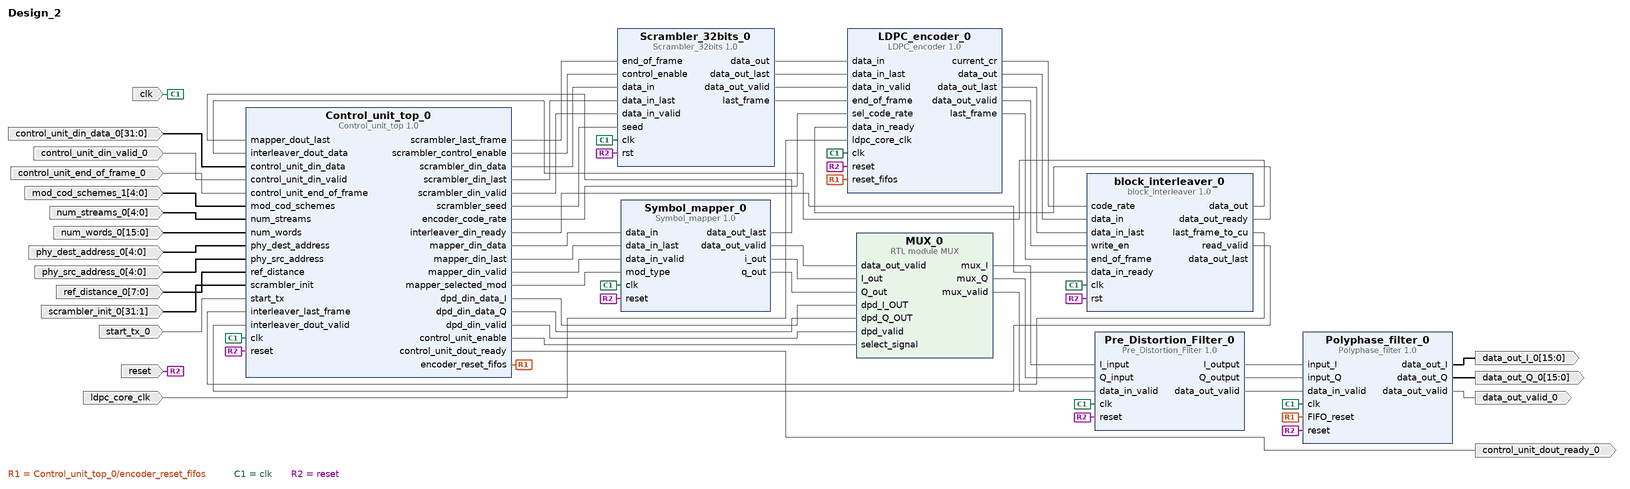
[diagram p0: block diagram of the top level]
# Vivado block design Design_2, xczu28dr-ffvg1517-2-e, Vivado 2021.2
create_bd_design Design_2

create_bd_port -dir I -type clk clk
set_property -dict {CONFIG.ASSOCIATED_RESET reset} [get_bd_ports clk]
create_bd_port -dir I -type clk ldpc_core_clk
create_bd_port -dir I -type rst reset
create_bd_port -dir O data_out_valid_0
create_bd_port -dir O -from 15 -to 0 data_out_I_0
create_bd_port -dir O -from 15 -to 0 data_out_Q_0
create_bd_port -dir O control_unit_dout_ready_0
create_bd_port -dir I -from 31 -to 0 control_unit_din_data_0
create_bd_port -dir I control_unit_din_valid_0
create_bd_port -dir I control_unit_end_of_frame_0
create_bd_port -dir I -from 31 -to 1 scrambler_init_0
create_bd_port -dir I -from 7 -to 0 ref_distance_0
create_bd_port -dir I -from 4 -to 0 num_streams_0
create_bd_port -dir I -from 15 -to 0 num_words_0
create_bd_port -dir I start_tx_0
create_bd_port -dir I -from 4 -to 0 phy_src_address_0
create_bd_port -dir I -from 4 -to 0 phy_dest_address_0
create_bd_port -dir I -from 4 -to 0 mod_cod_schemes_1

create_bd_cell -type ip -vlnv user.org:user:block_interleaver:1.0 block_interleaver_0
create_bd_cell -type ip -vlnv user.org:user:Scrambler_32bits:1.0 Scrambler_32bits_0
create_bd_cell -type ip -vlnv user.org:user:Pre_Distortion_Filter:1.0 Pre_Distortion_Filter_0
create_bd_cell -type module -reference MUX MUX_0
create_bd_cell -type ip -vlnv user.org:user:Symbol_mapper:1.0 Symbol_mapper_0
create_bd_cell -type ip -vlnv user.org:user:Control_unit_top:1.0 Control_unit_top_0
create_bd_cell -type ip -vlnv user.org:user:LDPC_encoder:1.0 LDPC_encoder_0
create_bd_cell -type ip -vlnv user.org:user:Polyphase_filter:1.0 Polyphase_filter_0

# ---- connections ----

connect_bd_net [get_bd_pins Control_unit_top_0/control_unit_dout_ready] [get_bd_ports control_unit_dout_ready_0]
connect_bd_net -net Control_unit_top_0_control_unit_last_frame [get_bd_pins Control_unit_top_0/scrambler_last_frame] \
  [get_bd_pins Scrambler_32bits_0/end_of_frame]
connect_bd_net [get_bd_pins Control_unit_top_0/dpd_din_data_I] [get_bd_pins MUX_0/dpd_I_OUT]
connect_bd_net [get_bd_pins Control_unit_top_0/dpd_din_data_Q] [get_bd_pins MUX_0/dpd_Q_OUT]
connect_bd_net [get_bd_pins Control_unit_top_0/dpd_din_valid] [get_bd_pins MUX_0/dpd_valid]
connect_bd_net [get_bd_pins Control_unit_top_0/encoder_code_rate] [get_bd_pins LDPC_encoder_0/sel_code_rate]
connect_bd_net [get_bd_pins Control_unit_top_0/encoder_reset_fifos] \
  [get_bd_pins LDPC_encoder_0/reset_fifos] [get_bd_pins Polyphase_filter_0/FIFO_reset]
connect_bd_net [get_bd_pins Control_unit_top_0/interleaver_din_ready] [get_bd_pins block_interleaver_0/data_in_ready]
connect_bd_net [get_bd_pins Control_unit_top_0/mapper_din_data] [get_bd_pins Symbol_mapper_0/data_in]
connect_bd_net [get_bd_pins Control_unit_top_0/mapper_din_last] [get_bd_pins Symbol_mapper_0/data_in_last]
connect_bd_net [get_bd_pins Control_unit_top_0/mapper_din_valid] [get_bd_pins Symbol_mapper_0/data_in_valid]
connect_bd_net -net Control_unit_top_0_mapper_pilot_insertion_en [get_bd_pins Control_unit_top_0/control_unit_enable] \
  [get_bd_pins MUX_0/select_signal]
connect_bd_net [get_bd_pins Control_unit_top_0/mapper_selected_mod] [get_bd_pins Symbol_mapper_0/mod_type]
connect_bd_net [get_bd_pins Control_unit_top_0/scrambler_control_enable] [get_bd_pins Scrambler_32bits_0/control_enable]
connect_bd_net [get_bd_pins Control_unit_top_0/scrambler_din_data] [get_bd_pins Scrambler_32bits_0/data_in]
connect_bd_net [get_bd_pins Control_unit_top_0/scrambler_din_last] [get_bd_pins Scrambler_32bits_0/data_in_last]
connect_bd_net [get_bd_pins Control_unit_top_0/scrambler_din_valid] [get_bd_pins Scrambler_32bits_0/data_in_valid]
connect_bd_net [get_bd_pins Control_unit_top_0/scrambler_seed] [get_bd_pins Scrambler_32bits_0/seed]
connect_bd_net [get_bd_pins LDPC_encoder_0/current_cr] [get_bd_pins block_interleaver_0/code_rate]
connect_bd_net -net LDPC_encoder_0_data_out_1_2 [get_bd_pins LDPC_encoder_0/data_out] [get_bd_pins block_interleaver_0/data_in]
connect_bd_net [get_bd_pins LDPC_encoder_0/data_out_last] [get_bd_pins block_interleaver_0/data_in_last]
connect_bd_net [get_bd_pins LDPC_encoder_0/data_out_valid] [get_bd_pins block_interleaver_0/write_en]
connect_bd_net [get_bd_pins LDPC_encoder_0/last_frame] [get_bd_pins block_interleaver_0/end_of_frame]
connect_bd_net [get_bd_pins MUX_0/mux_I] [get_bd_pins Pre_Distortion_Filter_0/I_input]
connect_bd_net [get_bd_pins MUX_0/mux_Q] [get_bd_pins Pre_Distortion_Filter_0/Q_input]
connect_bd_net [get_bd_pins MUX_0/mux_valid] [get_bd_pins Pre_Distortion_Filter_0/data_in_valid]
connect_bd_net [get_bd_pins Polyphase_filter_0/data_out_I] [get_bd_ports data_out_I_0]
connect_bd_net [get_bd_pins Polyphase_filter_0/data_out_Q] [get_bd_ports data_out_Q_0]
connect_bd_net [get_bd_pins Polyphase_filter_0/data_out_valid] [get_bd_ports data_out_valid_0]
connect_bd_net [get_bd_pins Pre_Distortion_Filter_0/I_output] [get_bd_pins Polyphase_filter_0/input_I]
connect_bd_net [get_bd_pins Pre_Distortion_Filter_0/Q_output] [get_bd_pins Polyphase_filter_0/input_Q]
connect_bd_net [get_bd_pins Pre_Distortion_Filter_0/data_out_valid] [get_bd_pins Polyphase_filter_0/data_in_valid]
connect_bd_net [get_bd_pins Scrambler_32bits_0/data_out] [get_bd_pins LDPC_encoder_0/data_in]
connect_bd_net [get_bd_pins Scrambler_32bits_0/data_out_last] [get_bd_pins LDPC_encoder_0/data_in_last]
connect_bd_net [get_bd_pins Scrambler_32bits_0/data_out_valid] [get_bd_pins LDPC_encoder_0/data_in_valid]
connect_bd_net [get_bd_pins Scrambler_32bits_0/last_frame] [get_bd_pins LDPC_encoder_0/end_of_frame]
connect_bd_net [get_bd_pins Symbol_mapper_0/data_out_last] [get_bd_pins Control_unit_top_0/mapper_dout_last]
connect_bd_net [get_bd_pins Symbol_mapper_0/data_out_valid] [get_bd_pins MUX_0/data_out_valid]
connect_bd_net [get_bd_pins Symbol_mapper_0/i_out] [get_bd_pins MUX_0/I_out]
connect_bd_net [get_bd_pins Symbol_mapper_0/q_out] [get_bd_pins MUX_0/Q_out]
connect_bd_net [get_bd_pins block_interleaver_0/data_out] [get_bd_pins Control_unit_top_0/interleaver_dout_data]
# net block_interleaver_0_data_out_last has one end: block_interleaver_0/data_out_last
connect_bd_net [get_bd_pins block_interleaver_0/data_out_ready] [get_bd_pins LDPC_encoder_0/data_in_ready]
connect_bd_net [get_bd_pins block_interleaver_0/last_frame_to_cu] [get_bd_pins Control_unit_top_0/interleaver_last_frame]
connect_bd_net [get_bd_pins block_interleaver_0/read_valid] [get_bd_pins Control_unit_top_0/interleaver_dout_valid]
connect_bd_net [get_bd_ports clk] \
  [get_bd_pins block_interleaver_0/clk] [get_bd_pins Scrambler_32bits_0/clk] [get_bd_pins Pre_Distortion_Filter_0/clk] \
  [get_bd_pins Symbol_mapper_0/clk] [get_bd_pins Control_unit_top_0/clk] [get_bd_pins LDPC_encoder_0/clk] \
  [get_bd_pins Polyphase_filter_0/clk]
connect_bd_net -net control_unit_din_data_0_1 [get_bd_ports control_unit_din_data_0] [get_bd_pins Control_unit_top_0/control_unit_din_data]
connect_bd_net -net control_unit_din_valid_0_1 [get_bd_ports control_unit_din_valid_0] [get_bd_pins Control_unit_top_0/control_unit_din_valid]
connect_bd_net -net control_unit_end_of_frame_0_1 [get_bd_ports control_unit_end_of_frame_0] \
  [get_bd_pins Control_unit_top_0/control_unit_end_of_frame]
connect_bd_net [get_bd_ports ldpc_core_clk] [get_bd_pins LDPC_encoder_0/ldpc_core_clk]
connect_bd_net -net mod_cod_schemes_1_1 [get_bd_ports mod_cod_schemes_1] [get_bd_pins Control_unit_top_0/mod_cod_schemes]
connect_bd_net -net num_streams_0_1 [get_bd_ports num_streams_0] [get_bd_pins Control_unit_top_0/num_streams]
connect_bd_net -net num_words_0_1 [get_bd_ports num_words_0] [get_bd_pins Control_unit_top_0/num_words]
connect_bd_net -net phy_dest_address_0_1 [get_bd_ports phy_dest_address_0] [get_bd_pins Control_unit_top_0/phy_dest_address]
connect_bd_net -net phy_src_address_0_1 [get_bd_ports phy_src_address_0] [get_bd_pins Control_unit_top_0/phy_src_address]
connect_bd_net -net ref_distance_0_1 [get_bd_ports ref_distance_0] [get_bd_pins Control_unit_top_0/ref_distance]
connect_bd_net [get_bd_ports reset] \
  [get_bd_pins block_interleaver_0/rst] [get_bd_pins Scrambler_32bits_0/rst] [get_bd_pins Pre_Distortion_Filter_0/reset] \
  [get_bd_pins Symbol_mapper_0/reset] [get_bd_pins Control_unit_top_0/reset] [get_bd_pins LDPC_encoder_0/reset] \
  [get_bd_pins Polyphase_filter_0/reset]
connect_bd_net -net scrambler_init_0_1 [get_bd_ports scrambler_init_0] [get_bd_pins Control_unit_top_0/scrambler_init]
connect_bd_net -net start_tx_0_1 [get_bd_ports start_tx_0] [get_bd_pins Control_unit_top_0/start_tx]

validate_bd_design
save_bd_design
